# EAGLE schematic SCIE1100 (EAGLE 7.6.0)
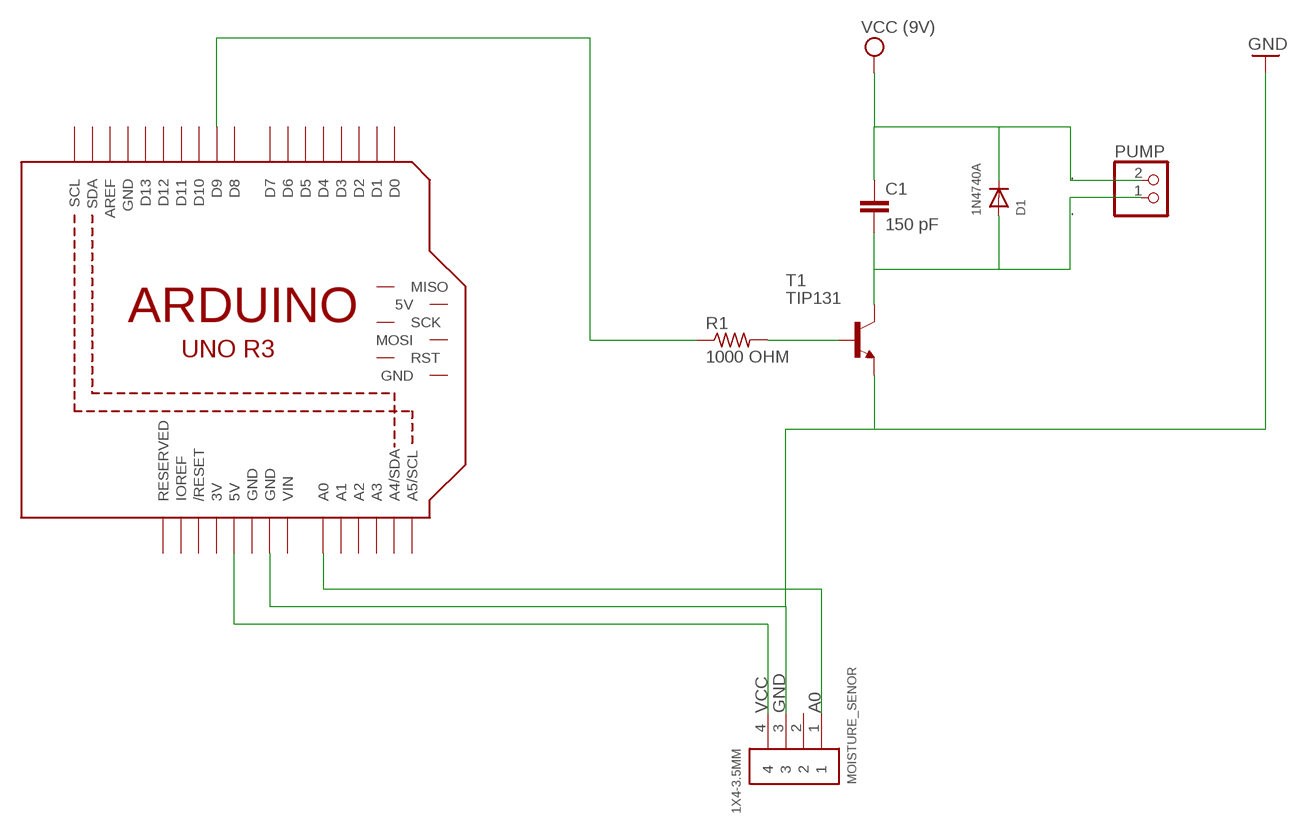
[diagram p0: schematic, sheet 1]

## Parts
C1  150 pF  C2,5-3  [C2.5-3]
D1  1N4740A  DIODEDO-1N4148  [DO-1N4148]
M1  ARDUINO_R3_ICSP  [ARDUINOR3_ICSP]
MOISTURE_SENOR  1X4-3.5MM  [1X04-3.5MM]
PUMP  JST_2PIN-SMT  [JST-PH-2-SMT]
R1  1000 OHM  R-US_0204/2V  [0204V]
T1  TIP131  2N2222  [TO92-EBC-OVAL]

## Nets
.: C1.1 C1.2 D1.A D1.C PUMP.1 PUMP.2 T1.C ; supply symbol labelled VCC (9V)
A0: M1.A0 MOISTURE_SENOR.1
GND: M1.GND@3(GND) MOISTURE_SENOR.3 T1.E
N$1: M1.D9 R1.1
N$2: R1.2 T1.B
VCC: M1.5V MOISTURE_SENOR.4
Unconnected: M1.5V_ICSP(5V) M1.A1 M1.A2 M1.A3 M1.A4(A4/SDA) M1.A5(A5/SCL) M1.AREF M1.D0 M1.D1 M1.D2 M1.D3 M1.D4 M1.D5 M1.D6 M1.D7 M1.D8 M1.D10 M1.D11 M1.D12 M1.D13 M1.GND@2(GND) M1.IOREF M1.MISO M1.MOSI M1.RESERVED M1.RESET(/RESET) M1.RESET_ICSP(RST) M1.SCK M1.SCL M1.SDA MOISTURE_SENOR.2

## Power pins joined to a net without a drawn wire
3V: M1.3V
GND: M1.GND M1.GND@1(GND)
VIN: M1.VIN

## Library data of the parts
C1 = capacitor-wima:C: CAPACITOR naming: grid - package width
D1 = adafruit:DIODE: Diode SMADIODE - SMA Surface Mount Package 20V 1A Schottky Diode Digikey: 641-1014-6-ND DO-1N4148 - Through Hole Small Current Diode SOD-123 20V 1 A (.5mV Vf) Schottky Diode - Digikey: MBRX120TPMSCT-ND SOD-323 10V 570mA (.38mV Vf, 3ns) Schottky Diode - Digikey: ZLLS410CT-ND SOD-523 30V 30mA Schottky Diode (RB751S-40TE61) - Digikey: RB751S-40TE61CT-ND SOT23-R/W - SOT23 Package (R = Solder Paste/Reflow Ovens, W = Hand-Soldering) BAT54Film 40V 300mA - Digikey: 497-7162-1-ND
M1 = adafruit:ARDUINO_R3_ICSP
MOISTURE_SENOR = adafruit:1X4: 4-pin connector
PUMP = adafruit:JST_2PIN: JST 2-Pin Connectors of various flavors SMT-RA (S2B-PH-SM4) 4UConnector #17311 SMT (B2B-PH-SM4) THM-RA (S2B-PH) THM (B2B-PH)
R1 = adafruit:R-US_: RESISTOR, American symbol
T1 = adafruit:2N2222: NPN TRANSISTOR Big oval pads